# Altium project LimeSDR-X3_1v2.PrjPcb (part 2 of 16)

## Sheet 10_LMS3_RF.SchDoc: LMS7002M RF (LMS3)
size A3; Organization: Lime Microsystems; Address1: Surrey Tech Centre; Address2: Guildford GU2 7YG; Address3: Surrey; Address4: United Kingdom; Revision: v1.1; SheetNumber: 10; SheetTotal: 31
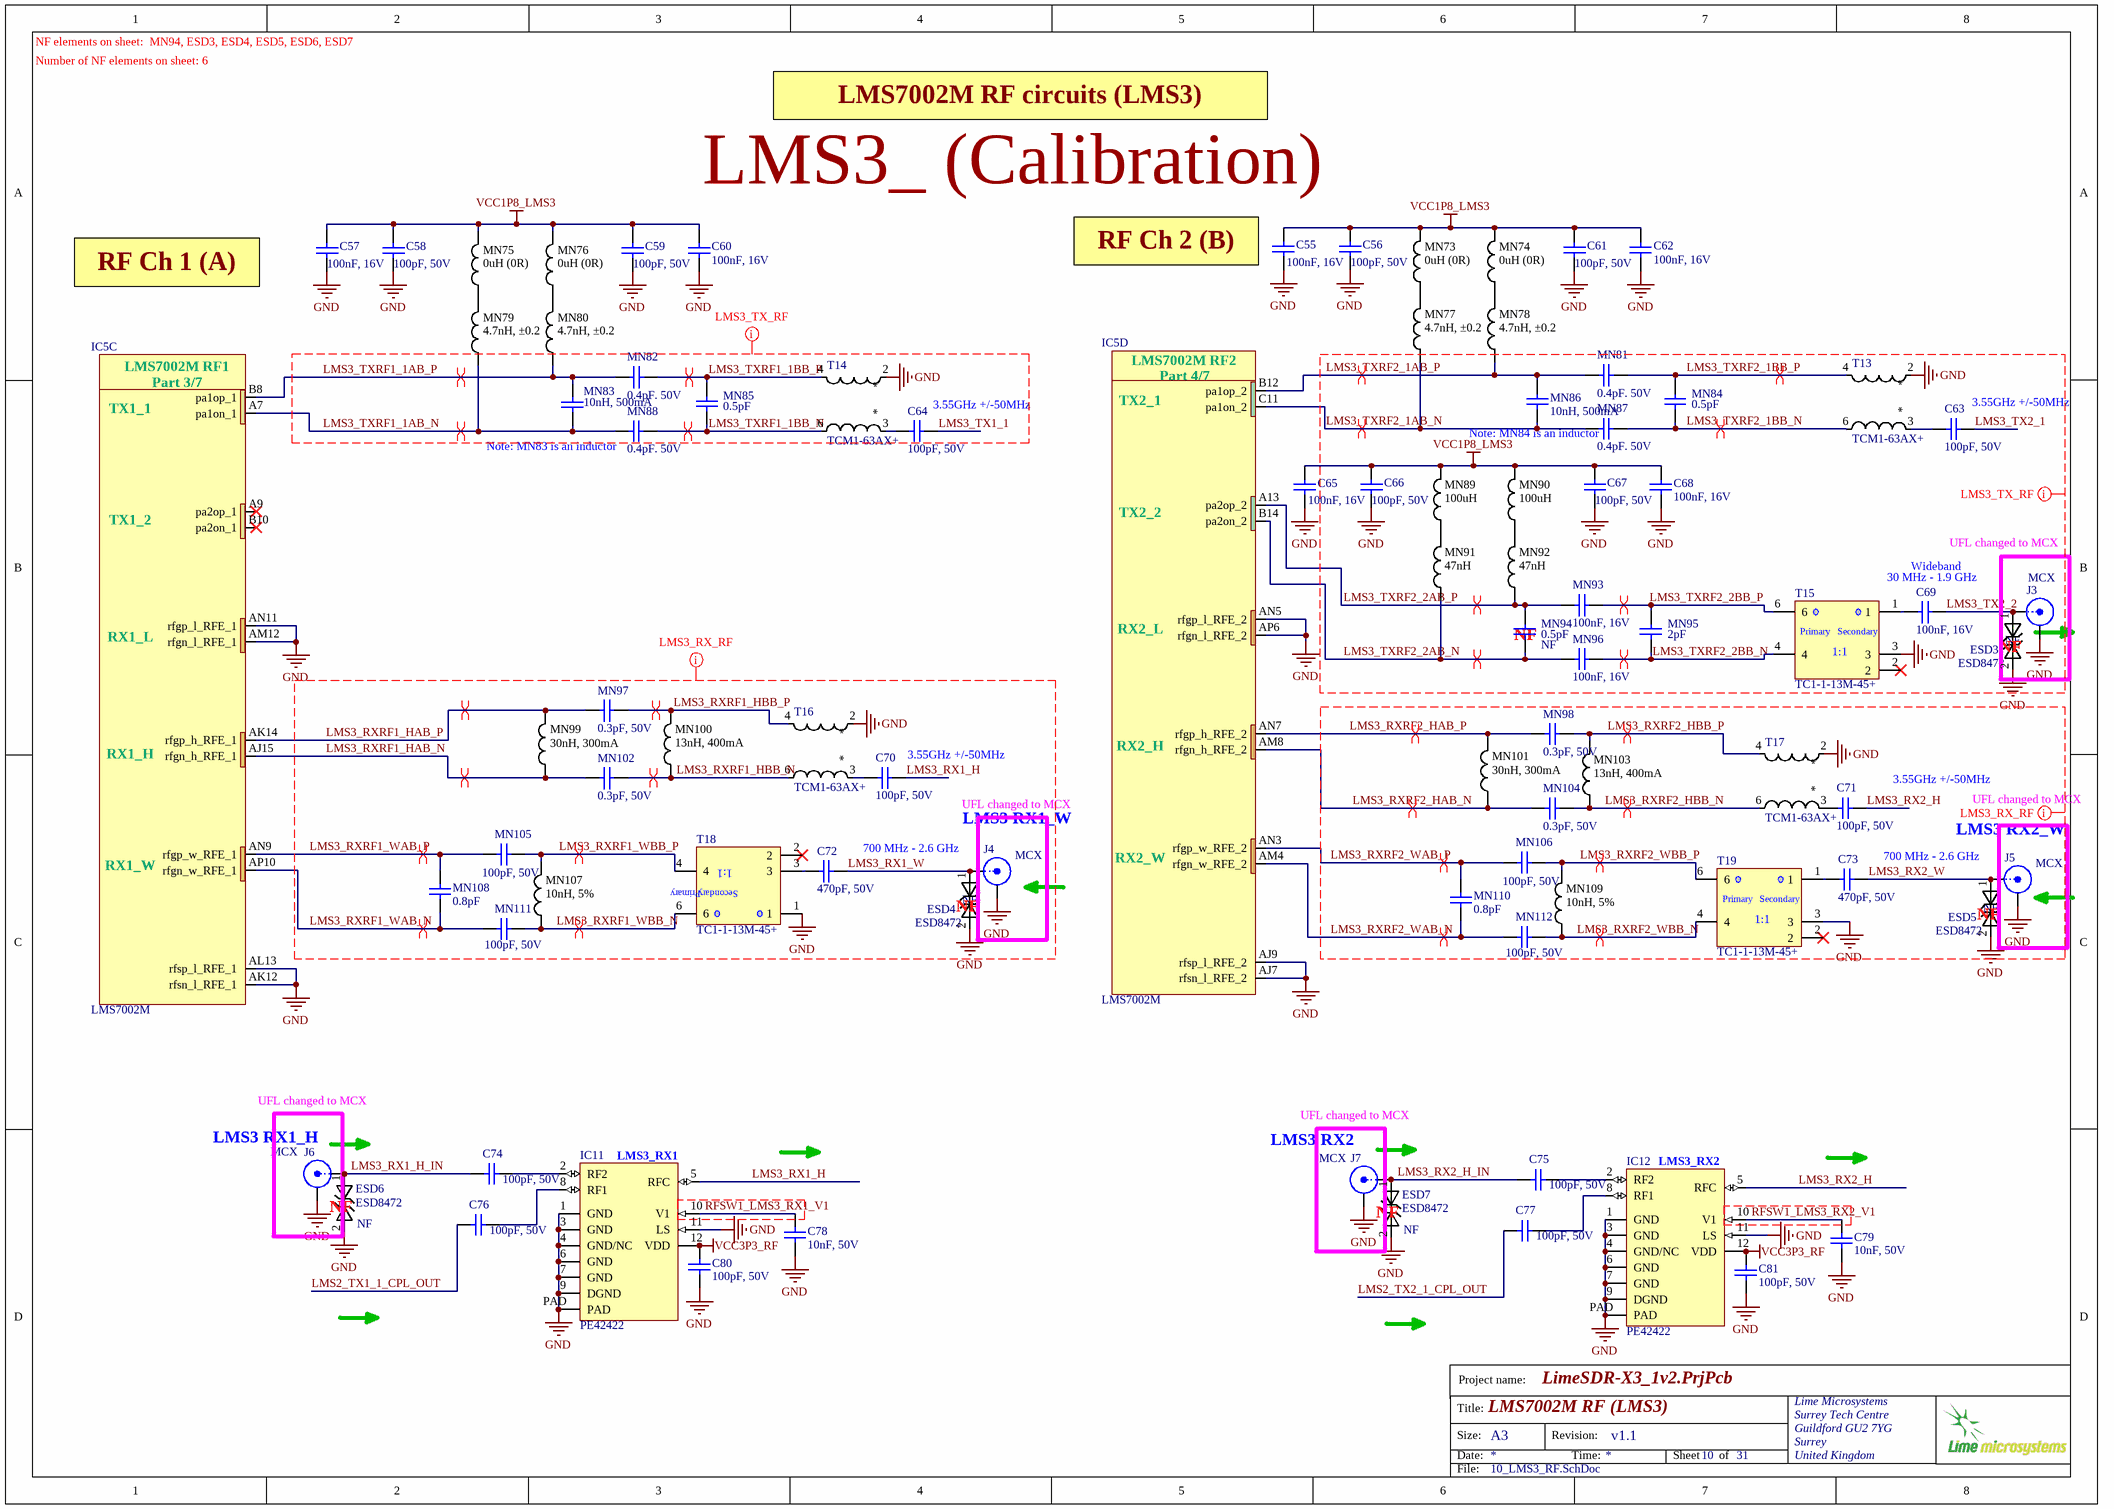
[diagram p2: 10_LMS3_RF.SchDoc]

### Parts
C55  100nF, 16V  [CAP0402]
C56  100pF, 50V  [CAP0402]
C57  100nF, 16V  [CAP0402]
C58  100pF, 50V  [CAP0402]
C59  100pF, 50V  [CAP0402]
C60  100nF, 16V  [CAP0402]
C61  100pF, 50V  [CAP0402]
C62  100nF, 16V  [CAP0402]
C63  100pF, 50V  [CAP0402]
C64  100pF, 50V  [CAP0402]
C65  100nF, 16V  [CAP0402]
C66  100pF, 50V  [CAP0402]
C67  100pF, 50V  [CAP0402]
C68  100nF, 16V  [CAP0402]
C69  100nF, 16V  [CAP0402]
C70  100pF, 50V  [CAP0402]
C71  100pF, 50V  [CAP0402]
C72  470pF, 50V  [CAP0402]
C73  470pF, 50V  [CAP0402]
C74  100pF, 50V  [CAP0402]
C75  100pF, 50V  [CAP0402]
C76  100pF, 50V  [CAP0402]
C77  100pF, 50V  [CAP0402]
C78  10nF, 50V  [CAP0402]
C79  10nF, 50V  [CAP0402]
C80  100pF, 50V  [CAP0402]
C81  100pF, 50V  [CAP0402]
ESD3  ESD8472  Assembly Info: NF  [ESD8472_X3DFN2]
ESD4  ESD8472  Assembly Info: NF  [ESD8472_X3DFN2]
ESD5  ESD8472  Assembly Info: NF  [ESD8472_X3DFN2]
ESD6  ESD8472  Assembly Info: NF  [ESD8472_X3DFN2]
ESD7  ESD8472  Assembly Info: NF  [ESD8472_X3DFN2]
IC5  LMS7002M  [LMS7002M_v5]  (parts C,D of 7)
IC11  PE42422  [PE42422_QFN12]
IC12  PE42422  [PE42422_QFN12]
J3  MCX  [MCX_connector_vertical_SM]
J4  MCX  [MCX_connector_vertical_SM]
J5  MCX  [MCX_connector_vertical_SM]
J6  MCX  [MCX_connector_vertical_SM]
J7  MCX  [MCX_connector_vertical_SM]
MN73  0uH (0R)  [RES0603]
MN74  0uH (0R)  [RES0603]
MN75  0uH (0R)  [RES0603]
MN76  0uH (0R)  [RES0603]
MN77  4.7nH, ±0.2  [RES0402]
MN78  4.7nH, ±0.2  [RES0402]
MN79  4.7nH, ±0.2  [RES0402]
MN80  4.7nH, ±0.2  [RES0402]
MN81  0.4pF. 50V  [CAP0402]
MN82  0.4pF. 50V  [CAP0402]
MN83  10nH, 500mA  [CAP0402]
MN84  0.5pF  [CAP0402]
MN85  0.5pF  [CAP0402]
MN86  10nH, 500mA  [CAP0402]
MN87  0.4pF. 50V  [CAP0402]
MN88  0.4pF. 50V  [CAP0402]
MN89  100uH  [RES0603]
MN90  100uH  [RES0603]
MN91  47nH  [RES0402]
MN92  47nH  [RES0402]
MN93  100nF, 16V  [CAP0402]
MN94  0.5pF  Assembly Info: NF  [CAP0402]
MN95  2pF  [CAP0402]
MN96  100nF, 16V  [CAP0402]
MN97  0.3pF, 50V  [CAP0402]
MN98  0.3pF, 50V  [CAP0402]
MN99  30nH, 300mA  [RES0402]
MN100  13nH, 400mA  [RES0402]
MN101  30nH, 300mA  [RES0402]
MN102  0.3pF, 50V  [CAP0402]
MN103  13nH, 400mA  [RES0402]
MN104  0.3pF, 50V  [CAP0402]
MN105  100pF, 50V  [CAP0402]
MN106  100pF, 50V  [CAP0402]
MN107  10nH, 5%  [RES0402]
MN108  0.8pF  [CAP0402]
MN109  10nH, 5%  [RES0402]
MN110  0.8pF  [CAP0402]
MN111  100pF, 50V  [CAP0402]
MN112  100pF, 50V  [CAP0402]
T13  TCM1-63AX+  [TCM1-63AX+_v2]
T14  TCM1-63AX+  [TCM1-63AX+_v2]
T15  TC1-1-13M-45+  [TC1-1-13MA+_JA4220-AL_]
T16  TCM1-63AX+  [TCM1-63AX+_v2]
T17  TCM1-63AX+  [TCM1-63AX+_v2]
T18  TC1-1-13M-45+  [TC1-1-13MA+_JA4220-AL_]
T19  TC1-1-13M-45+  [TC1-1-13MA+_JA4220-AL_]

### Nets
GND: C55.1 C56.1 C57.1 C58.1 C59.1 C60.1 C61.1 C62.1 C65.1 C66.1 C67.1 C68.1 C78.2 C79.2 C80.1 C81.1 ESD3.2 ESD4.2 ESD5.2 ESD6.2 ESD7.2 IC5.AJ7(rfsn_l_RFE_2) IC5.AJ9(rfsp_l_RFE_2) IC5.AK12(rfsn_l_RFE_1) IC5.AL13(rfsp_l_RFE_1) IC5.AM12(rfgn_l_RFE_1) IC5.AN5(rfgp_l_RFE_2) IC5.AN11(rfgp_l_RFE_1) IC5.AP6(rfgn_l_RFE_2) IC11.1(GND) IC11.3(GND) IC11.4(GND/NC) IC11.6(GND) IC11.7(GND) IC11.9(DGND) IC11.11(LS) IC11.PAD IC12.1(GND) IC12.3(GND) IC12.4(GND/NC) IC12.6(GND) IC12.7(GND) IC12.9(DGND) IC12.11(LS) IC12.PAD J3.2(Y) J4.2(Y) J5.2(Y) J6.2(Y) J7.2(Y) T13.2 T14.2 T15.3 T16.2 T17.2 T18.1 T19.3
VCC1P8_LMS3: C55.2 C56.2 C57.2 C58.2 C59.2 C60.2 C61.2 C62.2 C65.2 C66.2 C67.2 C68.2 MN73.2 MN74.2 MN75.2 MN76.2 MN89.2 MN90.2
VCC3P3_RF: C80.2 C81.2 IC11.12(VDD) IC12.12(VDD)
LMS2_TX1_1_CPL_OUT: C76.2
LMS2_TX2_1_CPL_OUT: C77.2
LMS3_RX1_H: C70.1 IC11.5(RFC)
LMS3_RX1_H_IN: C74.2 ESD6.1 J6.1(X)
LMS3_RX1_W: C72.1 ESD4.1 J4.1(X)
LMS3_RX2_H: C71.1 IC12.5(RFC)
LMS3_RX2_H_IN: C75.2 ESD7.1 J7.1(X)
LMS3_RX2_W: C73.1 ESD5.1 J5.1(X)
LMS3_RXRF1_HAB_N: IC5.AJ15(rfgn_h_RFE_1) MN99.1 MN102.2
LMS3_RXRF1_HAB_P: IC5.AK14(rfgp_h_RFE_1) MN97.2 MN99.2
LMS3_RXRF1_HBB_N: MN100.1 MN102.1 T16.6
LMS3_RXRF1_HBB_P: MN97.1 MN100.2 T16.4
LMS3_RXRF1_WAB_N: IC5.AP10(rfgn_w_RFE_1) MN108.2 MN111.2
LMS3_RXRF1_WAB_P: IC5.AN9(rfgp_w_RFE_1) MN105.2 MN108.1
LMS3_RXRF1_WBB_N: MN107.1 MN111.1 T18.6
LMS3_RXRF1_WBB_P: MN105.1 MN107.2 T18.4
LMS3_RXRF2_HAB_N: IC5.AM8(rfgn_h_RFE_2) MN101.1 MN104.2
LMS3_RXRF2_HAB_P: IC5.AN7(rfgp_h_RFE_2) MN98.2 MN101.2
LMS3_RXRF2_HBB_N: MN103.1 MN104.1 T17.6
LMS3_RXRF2_HBB_P: MN98.1 MN103.2 T17.4
LMS3_RXRF2_WAB_N: IC5.AM4(rfgn_w_RFE_2) MN110.2 MN112.2
LMS3_RXRF2_WAB_P: IC5.AN3(rfgp_w_RFE_2) MN106.2 MN110.1
LMS3_RXRF2_WBB_N: MN109.1 MN112.1 T19.4
LMS3_RXRF2_WBB_P: MN106.1 MN109.2 T19.6
LMS3_TX1_1: C64.1
LMS3_TX2_1: C63.1
LMS3_TX2_2: C69.1 ESD3.1 J3.1(X)
LMS3_TXRF1_1AB_N: IC5.A7(pa1on_1) MN79.1 MN83.2 MN88.2
LMS3_TXRF1_1AB_P: IC5.B8(pa1op_1) MN80.1 MN82.2 MN83.1
LMS3_TXRF1_1BB_N: MN85.1 MN88.1 T14.6
LMS3_TXRF1_1BB_P: MN82.1 MN85.2 T14.4
LMS3_TXRF2_1AB_N: IC5.C11(pa1on_2) MN77.1 MN86.1 MN87.2
LMS3_TXRF2_1AB_P: IC5.B12(pa1op_2) MN78.1 MN81.2 MN86.2
LMS3_TXRF2_1BB_N: MN84.1 MN87.1 T13.6
LMS3_TXRF2_1BB_P: MN81.1 MN84.2 T13.4
LMS3_TXRF2_2AB_N: IC5.B14(pa2on_2) MN91.1 MN94.1 MN96.1
LMS3_TXRF2_2AB_P: IC5.A13(pa2op_2) MN92.1 MN93.2 MN94.2
LMS3_TXRF2_2BB_N: MN95.1 MN96.2 T15.4
LMS3_TXRF2_2BB_P: MN93.1 MN95.2 T15.6
RFSW1_LMS3_RX1_V1: C78.1 IC11.10(V1)
RFSW1_LMS3_RX2_V1: C79.1 IC12.10(V1)
NetC63_2: C63.2 T13.3
NetC64_2: C64.2 T14.3
NetC69_2: C69.2 T15.1
NetC70_2: C70.2 T16.3
NetC71_2: C71.2 T17.3
NetC72_2: C72.2 T18.3
NetC73_2: C73.2 T19.1
NetC74_1: C74.1 IC11.2(RF2)
NetC75_1: C75.1 IC12.2(RF2)
NetC76_1: C76.1 IC11.8(RF1)
NetC77_1: C77.1 IC12.8(RF1)
NetMN73_1: MN73.1 MN77.2
NetMN74_1: MN74.1 MN78.2
NetMN75_1: MN75.1 MN79.2
NetMN76_1: MN76.1 MN80.2
NetMN89_1: MN89.1 MN91.2
NetMN90_1: MN90.1 MN92.2

Not connected (* = marked no-connect by the designer): IC5 A9(pa2op_1)* B10(pa2on_1)*; T15 2*; T18 2*; T19 2*

### Layout directives
differential pair: LMS3_RXRF1_HAB_N, LMS3_RXRF1_HAB_P, LMS3_RXRF1_HBB_N, LMS3_RXRF1_HBB_P, LMS3_RXRF1_WAB_N, LMS3_RXRF1_WAB_P, LMS3_RXRF1_WBB_N, LMS3_RXRF1_WBB_P, LMS3_RXRF2_HAB_N, LMS3_RXRF2_HAB_P, LMS3_RXRF2_HBB_N, LMS3_RXRF2_HBB_P, LMS3_RXRF2_WAB_N, LMS3_RXRF2_WAB_P, LMS3_RXRF2_WBB_N, LMS3_RXRF2_WBB_P, LMS3_TXRF1_1AB_N, LMS3_TXRF1_1AB_P, LMS3_TXRF1_1BB_N, LMS3_TXRF1_1BB_P, LMS3_TXRF2_1AB_N, LMS3_TXRF2_1AB_P, LMS3_TXRF2_1BB_N, LMS3_TXRF2_1BB_P, LMS3_TXRF2_2AB_N, LMS3_TXRF2_2AB_P, LMS3_TXRF2_2BB_N, LMS3_TXRF2_2BB_P
net class LMS3_TX_RF: GND, LMS3_TX1_1, LMS3_TX2_1, LMS3_TX2_2, LMS3_TXRF1_1AB_N, LMS3_TXRF1_1AB_P, LMS3_TXRF1_1BB_N, LMS3_TXRF1_1BB_P, LMS3_TXRF2_1AB_N, LMS3_TXRF2_1AB_P, LMS3_TXRF2_1BB_N, LMS3_TXRF2_1BB_P, LMS3_TXRF2_2AB_N, LMS3_TXRF2_2AB_P, LMS3_TXRF2_2BB_N, LMS3_TXRF2_2BB_P, VCC1P8_LMS3
net class LMS1_RX_RF: GND, LMS3_RX1_H, LMS3_RX1_W, LMS3_RXRF1_HAB_N, LMS3_RXRF1_HAB_P, LMS3_RXRF1_HBB_N, LMS3_RXRF1_HBB_P, LMS3_RXRF1_WAB_N, LMS3_RXRF1_WAB_P, LMS3_RXRF1_WBB_N, LMS3_RXRF1_WBB_P
net class LMS3_RX_RF: GND, LMS3_RX2_H, LMS3_RX2_W, LMS3_RXRF2_HAB_N, LMS3_RXRF2_HAB_P, LMS3_RXRF2_HBB_N, LMS3_RXRF2_HBB_P, LMS3_RXRF2_WAB_N, LMS3_RXRF2_WAB_P, LMS3_RXRF2_WBB_N, LMS3_RXRF2_WBB_P

### Notes on the sheet
- NF elements on sheet:  MN94, ESD3, ESD4, ESD5, ESD6, ESD7
- Number of NF elements on sheet: 6
- LMS7002M RF circuits (LMS3)
- LMS3_ (Calibration)
- RF Ch 1 (A)
- (near C55) RF Ch 2 (B)
- (near MN88) Note: MN83 is an inductor
- (near C64) 3.55GHz +/-50MHz
- (near MN87) Note: MN84 is an inductor
- (near C63) 3.55GHz +/-50MHz
- 30 MHz - 1.9 GHz
- Wideband
- UFL changed to MCX
- (near MN94) NF
- (near ESD3) NF
- (near C70) 3.55GHz +/-50MHz
- (near C71) 3.55GHz +/-50MHz
- 700 MHz - 2.6 GHz
- LMS3 RX1_W
- LMS3 RX2_W
- (near ESD4) NF
- (near ESD5) NF
- (near J6) LMS3 RX1_H
- (near IC11) LMS3_RX1
- (near J7) LMS3 RX2
- (near IC12) LMS3_RX2
- (near ESD6) NF
- (near ESD7) NF
- Project name:
- Title:
- Size:
- Date:
- A3
- Revision:
- Time:
- Sheet
- of
- File:
- (in symbol LMS7002Mr4, part C) LMS7002M RF1; Part 3/7; TX1_1; TX1_2; RX1_L; RX1_H; RX1_W
- (in symbol LMS7002Mr4, part D) LMS7002M RF2; Part 4/7; TX2_1; TX2_2; RX2_L; RX2_H; RX2_W
- (in symbol TC1-1-13M+) 1:1; Primary; Secondary

### Library data of the parts
C55 C57 C60 C62 C65 C68 C69 = Cap_0402: as C7 on sheet 08_LMS1_RF; Value: 100nF, 16V; Supplier 1: Mouser; Supplier Part Number 1: 81-GRM155R71C104KA88; Case Code - in: 0402; RoHS: RoHS Compliant; Operating Temperature Range: - 55 C to + 125 C; Series: GRM; Termination Style: SMD/SMT; Package / Case: 0402 (1005 metric); Voltage Rating DC: 16 V; Maximum Operating Temperature: + 125 C; Case Code - mm: 1005; Minimum Operating Temperature: - 55 C; Product Category: Low & Medium Capacitance SMD Ceramic Chip Capacitors; Packaging: Reel; Product: General Type MLCCs; Category: Multilayer Ceramic Capacitors MLCC - SMD/SMT; Brand: Murata Electronics; Case Width: 0.5 mm; RoHS - Mouser: Y; Standard Pack Qty: 10000; Minimum Order Quantity: 1; Reeling: True
C56 C58 C59 C61 C66 C67 = Cap_0402: as C8 on sheet 08_LMS1_RF; Value: 100pF, 50V; Supplier 1: Digi-Key; Supplier Part Number 1: 311-1024-1-ND; RoHS: RoHS Compliant; Category: Capacitors; Applications: General Purpose; Mounting Type: Surface Mount, MLCC; Capacitance: 100pF; Ratings: -; Packaging: Cut Tape (CT); Voltage - Rated: 50V; Size / Dimension: 0.039" L x 0.020" W (1.00mm x 0.50mm); Height - Seated (Max): -; Package / Case: 0402 (1005 Metric); Operating Temperature: -55°C ~ 125°C; Features: -; Lead Spacing: -; Lead Style: -; Thickness (Max): 0.022" (0.55mm)
C63 C64 C70 C71 C74-C77 C80 C81 MN105 MN106 MN111 MN112 = Cap_0402: as C15 on sheet 08_LMS1_RF; Value: 100pF, 50V; Capacitance: 100pF; Thickness (Max): 0.022" (0.55mm); Size / Dimension: 0.039" L x 0.020" W (1.00mm x 0.50mm); RoHS: RoHS Compliant; Ratings: -; Package / Case: 0402 (1005 Metric); Mounting Type: Surface Mount, MLCC; Height - Seated (Max): -; Features: -; Lead Spacing: -; Voltage - Rated: 50V; Operating Temperature: -55°C ~ 125°C; Packaging: Cut Tape (CT); Applications: General Purpose; Lead Style: -; Supplier 1: Digi-Key; Category: Capacitors; Supplier Part Number 1: 311-1024-1-ND
C72 C73 = Cap_0402: Manufacturer Part Number: C1005C0G1H471J050BA; Manufacturer: TDK Corporation; Part Description: 470pF ±5% 50V Ceramic Capacitor C0G, NP0 0402 (1005 Metric); Tolerance: ±5%; Temperature Coefficient: C0G, NP0; Value: 470pF, 50V; Supplier 1: Digi-Key; Supplier Part Number 1: 445-2656-6-ND; Ratings: -; Package / Case: 0402 (1005 Metric); Capacitance: 470pF; Packaging: Digi-Reel®; RoHS: RoHS Compliant; Lead Style: -; Thickness (Max): 0.022" (0.55mm); Size / Dimension: 0.039" L x 0.020" W (1.00mm x 0.50mm); Lead Spacing: -; Operating Temperature: -55°C ~ 125°C; Height - Seated (Max): -; Applications: General Purpose; Mounting Type: Surface Mount, MLCC; Voltage - Rated: 50V; Category: Capacitors; Features: -; Manufacturer Part Number 1: C1005C0G1H471J050BA
C78 C79 = Cap_0402: as C33 on sheet 08_LMS1_RF; Value: 10nF, 50V; Supplier 1: Digi-Key; Supplier Part Number 1: 490-4516-2-ND; RoHS: RoHS Compliant; Category: Capacitors; Stock 1: 10970000; Pricing 1: 10000=0.00185, 20000=0.00176, 30000=0.00167 (USD); Packaging: Tape & Reel (TR); Part Status: Active; Voltage - Rated: 50V; Operating Temperature: -55°C ~ 125°C; Features: -; Ratings: -; Applications: General Purpose; Mounting Type: Surface Mount, MLCC; Package / Case: 0402 (1005 Metric); Size / Dimension: 0.039" L x 0.020" W (1.00mm x 0.50mm); Height - Seated (Max): -; Thickness (Max): 0.022" (0.55mm); Lead Spacing: -; Lead Style: -; ComponentLink1URL: http://www.murata.com/~/media/webrenewal/support/library/catalog/products/capacitor/mlcc/c02e.ashx?la=en-us; ComponentLink1Description: http://www.murata.com/~/media/webrenewal/support/library/catalog/products/capacitor/mlcc/c02e.ashx?la=en-us
ESD3-ESD7 = ESD8472: as ESD1 on sheet 08_LMS1_RF; Supplier 1: Digi-Key; RoHS: RoHS Compliant; Category: Circuit Protection; Stock 1: 2295; Pricing 1: 1=0.39, 10=0.315, 100=0.2142, 500=0.16068, 1000=0.12051 (USD); Packaging: Cut Tape (CT); Part Status: Active; Type: Zener; Power - Peak Pulse: -; Applications: Automotive, RF Antenna; Operating Temperature: -55°C ~ 150°C (TJ); Mounting Type: Surface Mount; Package / Case: 2-XFDFN; Supplier Device Package: 2-X3DFN (0.62x0.32); ComponentLink1URL: http://www.onsemi.com/pub/Collateral/ESD8472-D.PDF; ComponentLink1Description: http://www.onsemi.com/pub/Collateral/ESD8472-D.PDF; Supplier Part Number 1: ESD8472MUT5GOSCT-ND
IC5 = LMS7002Mr4: as IC5 on sheet 07_LMS3_Misc; Supplier 1: Lime Microsystems; Supplier Part Number 1: LMS7002M; Manufacturer Part Number 1: LMS7002M
IC11 IC12 = PE42422: as IC7 on sheet 08_LMS1_RF; Supplier 1: Digi-Key; RoHS: RoHS Compliant; Category: RF/IF and RFID; Stock 1: 21993; Pricing 1: 1=1.32, 101=0.92 (USD); Packaging: Cut Tape (CT); Part Status: Active; P1dB: -; Features: -; Operating Temperature: -40°C ~ 85°C; Package / Case: 12-UFQFN Exposed Pad; Supplier Device Package: 12-QFN (2x2); ComponentLink1URL: http://www.psemi.com/pdf/datasheets/pe42422ds.pdf; ComponentLink1Description: http://www.psemi.com/pdf/datasheets/pe42422ds.pdf; Supplier Part Number 1: 1046-1062-1-ND
J3-J7 = RF_IF_connector: as J1 on sheet 08_LMS1_RF; ComponentLink1URL: https://datasheet.ciiva.com/5177/c908-22101t-37976-5177328.pdf?src-supplier=Mouser; ComponentLink1Description: https://datasheet.ciiva.com/5177/c908-22101t-37976-5177328.pdf?src-supplier=Mouser; ComponentLink2URL: https://datasheet.ciiva.com/643/c908-22101t-643558.pdf?src-supplier=Digi-Key; ComponentLink2Description: https://datasheet.ciiva.com/643/c908-22101t-643558.pdf?src-supplier=Digi-Key; ComponentLink3URL: https://datasheet.ciiva.com/7662/1636995-7662651.pdf?src-supplier=Element14; ComponentLink3Description: https://datasheet.ciiva.com/7662/1636995-7662651.pdf?src-supplier=Element14; ComponentLink4URL: https://datasheet.ciiva.com/5689/c908-22101t-5689787.pdf?src-supplier=Farnell; ComponentLink4Description: https://datasheet.ciiva.com/5689/c908-22101t-5689787.pdf?src-supplier=Farnell; ComponentLink5URL: https://datasheet.ciiva.com/7996/691284-7996807.pdf?src-supplier=Element14; ComponentLink5Description: https://datasheet.ciiva.com/7996/691284-7996807.pdf?src-supplier=Element14; ComponentLink6URL: https://datasheet.ciiva.com/643/c908-22101t-643559.pdf?src-supplier=Digi-Key; ComponentLink6Description: https://datasheet.ciiva.com/643/c908-22101t-643559.pdf?src-supplier=Digi-Key; ComponentLink7URL: https://datasheet.ciiva.com/643/c908-22101t-643560.pdf?src-supplier=Digi-Key; ComponentLink7Description: https://datasheet.ciiva.com/643/c908-22101t-643560.pdf?src-supplier=Digi-Key; Supplier 1: Digikey; Supplier Part Number 1: J548-ND; Stock 1: 6208; Pricing 1: 1=2,86, 10=2,595, 25=2,4576, 50=2,4006, 100=2,2862, 250=2,01248 (USD); RoHS: Yes; Housing Material: 152ConductorMaterial; ComponentLink8URL: https://datasheet.ciiva.com/643/dr-1333711201-643313.pdf?src-supplier=Digikey; ComponentLink8Description: https://datasheet.ciiva.com/643/dr-1333711201-643313.pdf?src-supplier=Digikey; ComponentLink9URL: https://datasheet.ciiva.com/3131/pi-133-3711-201-3131233.pdf?src-supplier=Avnet; ComponentLink9Description: https://datasheet.ciiva.com/3131/pi-133-3711-201-3131233.pdf?src-supplier=Avnet; ComponentLink10URL: https://datasheet.ciiva.com/23817/1720439-23817678.pdf?src-supplier=Newark; ComponentLink10Description: https://datasheet.ciiva.com/23817/1720439-23817678.pdf?src-supplier=Newark; ComponentLink11URL: https://datasheet.ciiva.com/23769/249599-23769434.pdf?src-supplier=Newark; ComponentLink11Description: https://datasheet.ciiva.com/23769/249599-23769434.pdf?src-supplier=Newark; ComponentLink12URL: https://datasheet.ciiva.com/22686/1720437-22686743.pdf?src-supplier=Element14; ComponentLink12Description: https://datasheet.ciiva.com/22686/1720437-22686743.pdf?src-supplier=Element14
MN73 MN75 = Inductor_0603: as MN1 on sheet 08_LMS1_RF; Value: 0uH (0R); Supplier 1: Digi-Key; Supplier Part Number 1: P0.0GCT-ND; RoHS: RoHS Compliant; Category: Resistors; Stock 1: 31663129; Pricing 1: 1=0.1, 10=0.04, 25=0.0292, 50=0.0222, 100=0.0164, 250=0.01252, 500=0.01002, 1000=0.00737 (USD); Packaging: Cut Tape (CT); Part Status: Active; Composition: Thick Film; Features: Automotive AEC-Q200; Temperature Coefficient: -; Operating Temperature: -55°C ~ 155°C; Package / Case: 0603 (1608 Metric); Supplier Device Package: 0603; Size / Dimension: 0.063" L x 0.032" W (1.60mm x 0.80mm); Height - Seated (Max): 0.022" (0.55mm); Failure Rate: -; ComponentLink1URL: http://industrial.panasonic.com/www-cgi/jvcr13pz.cgi?E+PZ+3+AOA0001+ERJ3GEY0R00V+7+WW; ComponentLink1Description: http://industrial.panasonic.com/www-cgi/jvcr13pz.cgi?E+PZ+3+AOA0001+ERJ3GEY0R00V+7+WW; Manufacturer Part Number 1: ERJ-3GEY0R00V
MN74 MN76 = Inductor_0603: as MN2 on sheet 08_LMS1_RF; Value: 0uH (0R); Category: Resistors; ComponentLink1Description: http://industrial.panasonic.com/www-cgi/jvcr13pz.cgi?E+PZ+3+AOA0001+ERJ3GEY0R00V+7+WW; ComponentLink1URL: http://industrial.panasonic.com/www-cgi/jvcr13pz.cgi?E+PZ+3+AOA0001+ERJ3GEY0R00V+7+WW; Composition: Thick Film; Failure Rate: -; Features: Automotive AEC-Q200; Height - Seated (Max): 0.022" (0.55mm); Operating Temperature: -55°C ~ 155°C; Package / Case: 0603 (1608 Metric); Packaging: Cut Tape (CT); Part Status: Active; Pricing 1: 1=0.1, 10=0.04, 25=0.0292, 50=0.0222, 100=0.0164, 250=0.01252, 500=0.01002, 1000=0.00737 (USD); RoHS: RoHS Compliant; Size / Dimension: 0.063" L x 0.032" W (1.60mm x 0.80mm); Stock 1: 31663129; Supplier 1: Digi-Key; Supplier Device Package: 0603; Supplier Part Number 1: P0.0GCT-ND; Temperature Coefficient: -; Manufacturer Part Number 1: ERJ-3GEY0R00V
MN77-MN80 = Inductor_0603: Manufacturer: Murata; Manufacturer Part Number 1: LQW15AN4N7C00D; Part Description: 4.7nH Unshielded Wirewound Inductor 750mA 70mOhm Max 0402 (1006 Metric); Core Material: Air; Current Rating: 750mA; DC Resistance (DCR): 70mR; Q Factor: 25; Self Resonant Frequency: 8GHz; Shielding: Unshielded; Test Frequency: 100MHz; Case/Package: 0402; Case Code (Imperial): 0402; Case Code (Metric): 1005; DC Current: 750mA; Depth: 0.7mm; Height: 0.5mm; Inductance: 4.7nH; Lead Free: Lead Free; Length: 1mm; Max DC Current: 750mA; Max Operating Temperature: 125°C; Military Standard: Not; Min Operating Temperature: -55°C; Mount: Surface Mount; Number of Pins: 2; Package Quantity: 10000; Packaging: Tape and Reel; Pricing 1: 1=0,18000, 10=0,16300, 100=0,10870, 500=0,09058, 1000=0,07608, 2500=0,06522 (USD); Radiation Hardening: No; REACH SVHC: No SVHC; RoHS: Yes; Stock 1: 48802; Supplier 1: Digi-Key; Supplier Part Number 1: 490-1139-1-ND; Termination: SMD/SMT; Value: 4.7nH, ±0.2; Weight: 2.8E-05oz; Width: 0.02inch
MN81 MN82 MN87 MN88 = Cap_0402: Part Description: 0.4 pF ±0.05pF 50V Ceramic Capacitor C0G, NP0 0402 (1005 Metric); Manufacturer: Murata; Manufacturer Part Number 1: GJM1555C1HR40WB01D; Capacitance: 0.4pF; Dielectric: C0G; Value: 0.4pF. 50V; Supplier 1: Arrow Electronics; Supplier Part Number 1: GJM1555C1HR40WB01D; Stock 1: 12385; Pricing 1: 1=0,20210, 10=0,14340, 25=0,12680, 100=0,08350, 250=0,08280, 500=0,07340, 1000=0,07270, 3000=0,07200, 6000=0,04460 (USD); RoHS: Yes; Mount: Surface Mount; Case/Package: 0402; Case Code (Metric): 1005; Case Code (Imperial): 0402; Min Operating Temperature: -55°C; Max Operating Temperature: 125°C; Packaging: Tape and Reel; Package Quantity: 10000; Voltage Rating: 50V; Voltage Rating (DC): 50V; Termination: SMD/SMT; Series: GJM; Construction: Flat; Length: 1mm; Width: 0.02inch; Height: 0.5mm; Thickness: 0.022inch; Depth: 0.5mm; Radiation Hardening: No; Lead Free: Lead Free; RoHS Compliant: Yes; ComponentLink1URL: https://datasheet.ciiva.com/11621/product-11621841.pdf?src-supplier=Avnet; ComponentLink1Description: https://datasheet.ciiva.com/11621/product-11621841.pdf?src-supplier=Avnet; ComponentLink2URL: https://datasheet.ciiva.com/169/partnumbering-e-01-169682.pdf?src-supplier=Digi-Key; ComponentLink2Description: https://datasheet.ciiva.com/169/partnumbering-e-01-169682.pdf?src-supplier=Digi-Key
MN83 MN86 = Cap_0402: Part Description: 10 nH Unshielded Wirewound Inductor 500 mA 170mOhm Max 0402 (1005 Metric); Manufacturer: Murata; Manufacturer Part Number 1: LQW15AN10NG00D; Core Material: Non-Magnetic,Air,Ferrite; Tolerance: 2%; Shielding: Unshielded; DC Resistance (DCR): 170mR; Self Resonant Frequency: 5.5GHz; Test Frequency: 100MHz; Current: 370mA; Value: 10nH, 500mA; Supplier 1: Arrow Electronics; Supplier Part Number 1: LQW15AN10NG00D; Stock 1: 20000; Pricing 1: 10000=0,07910, 20000=0,05460 (USD); RoHS: Yes; Mount: Surface Mount; Case/Package: 0402; Number of Pins: 2; Weight: 2.8E-05oz; Case Code (Metric): 1005; Case Code (Imperial): 0402; Min Operating Temperature: -55°C; Max Operating Temperature: 125°C; Inductance Tolerance: 2%; Packaging: Tape and Reel; Package Quantity: 10000; Current Rating: 500mA; Resistor Type: Wirewound; Inductance: 10nH; Max DC Current: 500mA; Termination: SMD/SMT; DC Current: 500mA; Length: 1mm; Width: 0.02inch; Height: 0.5mm; Height - Seated (Max): 0.024inch; Depth: 0.7mm; Radiation Hardening: No; REACH SVHC: No SVHC; Military Standard: Not; Lead Free: Lead Free; RoHS Compliant: Yes; ComponentLink1URL: https://datasheet.ciiva.com/11799/0900766b8090d800-11799107.pdf?src-supplier=RSComponents; ComponentLink1Description: https://datasheet.ciiva.com/11799/0900766b8090d800-11799107.pdf?src-supplier=RSComponents; ComponentLink2URL: https://datasheet.ciiva.com/6705/l0075s0080lqw15a-00-6705338.pdf?src-supplier=Digi-Key; ComponentLink2Description: https://datasheet.ciiva.com/6705/l0075s0080lqw15a-00-6705338.pdf?src-supplier=Digi-Key; ComponentLink3URL: https://datasheet.ciiva.com/6705/l0075s0080lqw15a-00-6705337.pdf?src-supplier=Digi-Key; ComponentLink3Description: https://datasheet.ciiva.com/6705/l0075s0080lqw15a-00-6705337.pdf?src-supplier=Digi-Key; ComponentLink4URL: https://datasheet.ciiva.com/6705/l0075s0080lqw15a-00-6705339.pdf?src-supplier=Digi-Key; ComponentLink4Description: https://datasheet.ciiva.com/6705/l0075s0080lqw15a-00-6705339.pdf?src-supplier=Digi-Key; ComponentLink5URL: https://datasheet.ciiva.com/4977/product-4977514.pdf?src-supplier=Mouser; ComponentLink5Description: https://datasheet.ciiva.com/4977/product-4977514.pdf?src-supplier=Mouser; ComponentLink6URL: https://datasheet.ciiva.com/8508/l0075s0080lqw15a-00-8508734.pdf?src-supplier=Avnet; ComponentLink6Description: https://datasheet.ciiva.com/8508/l0075s0080lqw15a-00-8508734.pdf?src-supplier=Avnet; ComponentLink7URL: https://datasheet.ciiva.com/25644/l0075s0080lqw15a-00-25644999.pdf?src-supplier=Future+Electronics; ComponentLink7Description: https://datasheet.ciiva.com/25644/l0075s0080lqw15a-00-25644999.pdf?src-supplier=Future+Electronics
MN84 MN85 MN94 = Cap_0402: as MN12 on sheet 08_LMS1_RF; Value: 0.5pF; Supplier 1: Digi-Key; Supplier Part Number 1: 311-1001-1-ND; RoHS: RoHS Compliant; Thickness (Max): 0.022" (0.55mm); Features: -; Height - Seated (Max): -; Lead Spacing: -; Applications: General Purpose; Packaging: Cut Tape (CT); Ratings: -; Size / Dimension: 0.039" L x 0.020" W (1.00mm x 0.50mm); Lead Style: -; Mounting Type: Surface Mount, MLCC; Operating Temperature: -55°C ~ 125°C; Package / Case: 0402 (1005 Metric); Category: Capacitors
MN89 = Inductor_0603: as MN17 on sheet 08_LMS1_RF; Value: 100uH; Supplier 1: Digi-Key; Supplier Part Number 1: 445-6150-6-ND; RoHS: RoHS Compliant; Category: Inductors, Coils, Chokes; Stock 1: 127797; Pricing 1: 1=0.27, 10=0.244, 100=0.1676, 500=0.14324, 1000=0.10971 (USD); Packaging: Digi-Reel®; Part Status: Active; Type: Wirewound; Material - Core: -; Q @ Freq: -; Ratings: -; Operating Temperature: -40°C ~ 105°C; Mounting Type: Surface Mount; Package / Case: 0603 (1608 Metric); Supplier Device Package: 0603 (1608 Metric); Size / Dimension: 0.063" L x 0.031" W (1.60mm x 0.80mm); Height - Seated (Max): 0.039" (1.00mm); ComponentLink1URL: https://media.digikey.com/pdf/Data%20Sheets/TDK%20PDFs/GLFR%20Series.pdf; ComponentLink1Description: https://media.digikey.com/pdf/Data%20Sheets/TDK%20PDFs/GLFR%20Series.pdf; Manufacturer Part Number 1: GLFR1608T101M-LR
MN90 = Inductor_0603: as MN19 on sheet 08_LMS1_RF; Value: 100uH; Category: Inductors, Coils, Chokes; ComponentLink1Description: https://media.digikey.com/pdf/Data%20Sheets/TDK%20PDFs/GLFR%20Series.pdf; ComponentLink1URL: https://media.digikey.com/pdf/Data%20Sheets/TDK%20PDFs/GLFR%20Series.pdf; Height - Seated (Max): 0.039" (1.00mm); Material - Core: -; Mounting Type: Surface Mount; Operating Temperature: -40°C ~ 105°C; Package / Case: 0603 (1608 Metric); Packaging: Digi-Reel®; Part Status: Active; Pricing 1: 1=0.27, 10=0.244, 100=0.1676, 500=0.14324, 1000=0.10971 (USD); Q @ Freq: -; Ratings: -; RoHS: RoHS Compliant; Size / Dimension: 0.063" L x 0.031" W (1.60mm x 0.80mm); Stock 1: 127797; Supplier 1: Digi-Key; Supplier Device Package: 0603 (1608 Metric); Supplier Part Number 1: 445-6150-6-ND; Type: Wirewound; Manufacturer Part Number 1: GLFR1608T101M-LR
MN91 MN92 = Inductor_0603: as MN21 on sheet 08_LMS1_RF; Supplier 1: Farnell; Supplier Part Number 1: 2285856; Packaging: Cut Tape; Inductor Case Style: 0402 [1005 Metric]; RoHS: Y-EX; value: 47nH
MN93 MN96 = Cap_0402: as MN25 on sheet 08_LMS1_RF; Value: 100nF, 16V; Supplier 1: Mouser; Supplier Part Number 1: 81-GRM155R71C104KA88; Case Code - in: 0402; RoHS: RoHS Compliant; Operating Temperature Range: - 55 C to + 125 C; Series: GRM; Termination Style: SMD/SMT; Package / Case: 0402 (1005 metric); Voltage Rating DC: 16 V; Type: General Purpose MLCC; Maximum Operating Temperature: + 125 C; Case Code - mm: 1005; Minimum Operating Temperature: - 55 C; Product Category: Low & Medium Capacitance SMD Ceramic Chip Capacitors; Packaging: Reel; Product: General Type MLCCs; Category: Multilayer Ceramic Capacitors MLCC - SMD/SMT; Brand: Murata Electronics; Case Width: 0.5 mm; RoHS - Mouser: Y; Standard Pack Qty: 10000; Minimum Order Quantity: 1; Reeling: True
MN95 = Cap_0402: as MN28 on sheet 08_LMS1_RF; Value: 2pF; Supplier 1: Farnell; Supplier Part Number 1: 2332536; Operating Temperature Max: 125; RoHS: YES; Operating Temperature Min: -55; Capacitance Tolerance ±: ± 0.1; Packaging: Cut Tape; MSL: MSL 1 - Unlimited; Manufacturer Part Number 1: 04025U2R0BAT2A
MN97 MN98 MN102 MN104 = Cap_0402: Part Description: 0.3 pF ±0.1pF 50V Ceramic Capacitor C0G, NP0 0402 (1005 Metric); Manufacturer: Johanson; Manufacturer Part Number 1: QSCF500Q0R3B1GV001T; Value: 0.3pF, 50V; ComponentLink1URL: https://datasheet.ciiva.com/11617/product-11617574.pdf?src-supplier=Avnet; ComponentLink1Description: https://datasheet.ciiva.com/11617/product-11617574.pdf?src-supplier=Avnet; ComponentLink2URL: https://datasheet.ciiva.com/169/partnumbering-e-01-169995.pdf?src-supplier=Digi-Key; ComponentLink2Description: https://datasheet.ciiva.com/169/partnumbering-e-01-169995.pdf?src-supplier=Digi-Key; ComponentLink3URL: https://datasheet.ciiva.com/6263/grm1555c1hr10wa01-01-6263952.pdf?src-supplier=Digi-Key; ComponentLink3Description: https://datasheet.ciiva.com/6263/grm1555c1hr10wa01-01-6263952.pdf?src-supplier=Digi-Key; ComponentLink4URL: https://datasheet.ciiva.com/6263/partnumbering-e-01-6263949.pdf?src-supplier=Digi-Key; ComponentLink4Description: https://datasheet.ciiva.com/6263/partnumbering-e-01-6263949.pdf?src-supplier=Digi-Key; ComponentLink5URL: https://datasheet.ciiva.com/6263/partnumbering-e-01-6263947.pdf?src-supplier=Digi-Key; ComponentLink5Description: https://datasheet.ciiva.com/6263/partnumbering-e-01-6263947.pdf?src-supplier=Digi-Key; ComponentLink6URL: https://datasheet.ciiva.com/5414/product-5414742.pdf?src-supplier=Mouser; ComponentLink6Description: https://datasheet.ciiva.com/5414/product-5414742.pdf?src-supplier=Mouser; ComponentLink7URL: https://datasheet.ciiva.com/11618/product-11618981.pdf?src-supplier=Avnet; ComponentLink7Description: https://datasheet.ciiva.com/11618/product-11618981.pdf?src-supplier=Avnet; Supplier 1: DigiKey; Supplier Part Number 1: 712-QSCF500Q0R3B1GV001TCT-ND; Stock 1: 139276; Pricing 1: 1=0,13, 10=0,093, 50=0,053, 100=0,0439, 500=0,0308, 1000=0,0255, 2500=0,02374, 5000=0,02172 (USD); RoHS: Yes; RoHS Compliant: Yes
MN99 MN101 = Inductor_0603: Part Description: 30 nH Unshielded Multilayer Inductor 300 mA 800mOhm Max 0402 (1005 Metric); Manufacturer: TDK; Manufacturer Part Number 1: MLG1005S30NJT000; Core Material: Non-Magnetic; Tolerance: 5%; Shielding: Unshielded; DC Resistance (DCR): 800mR; Self Resonant Frequency: 1.5GHz; Test Frequency: 100MHz; Value: 30nH, 300mA; ComponentLink1URL: https://datasheet.ciiva.com/11801/0900766b8090d800-11801389.pdf?src-supplier=RSComponents; ComponentLink1Description: https://datasheet.ciiva.com/11801/0900766b8090d800-11801389.pdf?src-supplier=RSComponents; ComponentLink2URL: https://datasheet.ciiva.com/17278/l0075s0080lqw15a-00-17278445.pdf?src-supplier=Avnet+Europe; ComponentLink2Description: https://datasheet.ciiva.com/17278/l0075s0080lqw15a-00-17278445.pdf?src-supplier=Avnet+Europe; ComponentLink3URL: https://datasheet.ciiva.com/16455/l0075s0080lqw15a-00-16455931.pdf?src-supplier=Future+Electronics; ComponentLink3Description: https://datasheet.ciiva.com/16455/l0075s0080lqw15a-00-16455931.pdf?src-supplier=Future+Electronics; ComponentLink4URL: https://datasheet.ciiva.com/11799/0900766b8090d800-11799107.pdf?src-supplier=RSComponents; ComponentLink4Description: https://datasheet.ciiva.com/11799/0900766b8090d800-11799107.pdf?src-supplier=RSComponents; ComponentLink5URL: https://datasheet.ciiva.com/6705/l0075s0080lqw15a-00-6705338.pdf?src-supplier=Digi-Key; ComponentLink5Description: https://datasheet.ciiva.com/6705/l0075s0080lqw15a-00-6705338.pdf?src-supplier=Digi-Key; ComponentLink6URL: https://datasheet.ciiva.com/6705/l0075s0080lqw15a-00-6705337.pdf?src-supplier=Digi-Key; ComponentLink6Description: https://datasheet.ciiva.com/6705/l0075s0080lqw15a-00-6705337.pdf?src-supplier=Digi-Key; ComponentLink7URL: https://datasheet.ciiva.com/6705/l0075s0080lqw15a-00-6705339.pdf?src-supplier=Digi-Key; ComponentLink7Description: https://datasheet.ciiva.com/6705/l0075s0080lqw15a-00-6705339.pdf?src-supplier=Digi-Key; ComponentLink8URL: https://datasheet.ciiva.com/4977/product-4977514.pdf?src-supplier=Mouser; ComponentLink8Description: https://datasheet.ciiva.com/4977/product-4977514.pdf?src-supplier=Mouser; ComponentLink9URL: https://datasheet.ciiva.com/8508/l0075s0080lqw15a-00-8508734.pdf?src-supplier=Avnet; ComponentLink9Description: https://datasheet.ciiva.com/8508/l0075s0080lqw15a-00-8508734.pdf?src-supplier=Avnet; ComponentLink10URL: https://datasheet.ciiva.com/25644/l0075s0080lqw15a-00-25644999.pdf?src-supplier=Future+Electronics; ComponentLink10Description: https://datasheet.ciiva.com/25644/l0075s0080lqw15a-00-25644999.pdf?src-supplier=Future+Electronics; Supplier 1: Digi-Key; Supplier Part Number 1: 445-6312-1-ND; Stock 1: 41662; Pricing 1: 1=0,13, 10=0,115, 25=0,1024, 50=0,0868, 100=0,0767, 250=0,07028, 500=0,06388, 1000=0,05366, 2500=0,046 (USD); RoHS: Yes; Mount: Surface Mount; Case/Package: 0402; Case Code (Metric): 1005; Case Code (Imperial): 0402; Min Operating Temperature: -55°C; Max Operating Temperature: 125°C; Current Rating: 300mA; Package Quantity: 10000; Packaging: Cut Tape; Inductance: 30nH; Series: MLG; Length: 0.039inch; Width: 0.02inch; Height - Seated (Max): 0.022inch; RoHS Compliant: Yes; ComponentLink11URL: https://datasheet.ciiva.com/29696/inductor-commercial-high-frequency-mlg-en-29696712.pdf?src-supplier=Digi-Key; ComponentLink11Description: https://datasheet.ciiva.com/29696/inductor-commercial-high-frequency-mlg-en-29696712.pdf?src-supplier=Digi-Key; ComponentLink12URL: https://datasheet.ciiva.com/29696/inductor-commercial-high-frequency-mlg-en-29696711.pdf?src-supplier=Digi-Key; ComponentLink12Description: https://datasheet.ciiva.com/29696/inductor-commercial-high-frequency-mlg-en-29696711.pdf?src-supplier=Digi-Key; ComponentLink13URL: https://datasheet.ciiva.com/29696/inductor-commercial-high-frequency-mlg-en-29696710.pdf?src-supplier=Digi-Key; ComponentLink13Description: https://datasheet.ciiva.com/29696/inductor-commercial-high-frequency-mlg-en-29696710.pdf?src-supplier=Digi-Key
MN100 MN103 = Inductor_0603: Part Description: 13 nH Unshielded Multilayer Inductor 400 mA 500mOhm Max 0402 (1005 Metric); Manufacturer: TDK; Manufacturer Part Number 1: MLG1005S13NJT000; Core Material: Non-Magnetic,Ceramic; Tolerance: 5%; Shielding: Unshielded; DC Resistance (DCR): 500mR; Self Resonant Frequency: 2.4GHz; Test Frequency: 100MHz; Value: 13nH, 400mA; ComponentLink1URL: https://datasheet.ciiva.com/11801/0900766b8090d800-11801389.pdf?src-supplier=RSComponents; ComponentLink1Description: https://datasheet.ciiva.com/11801/0900766b8090d800-11801389.pdf?src-supplier=RSComponents; ComponentLink2URL: https://datasheet.ciiva.com/17278/l0075s0080lqw15a-00-17278445.pdf?src-supplier=Avnet+Europe; ComponentLink2Description: https://datasheet.ciiva.com/17278/l0075s0080lqw15a-00-17278445.pdf?src-supplier=Avnet+Europe; ComponentLink3URL: https://datasheet.ciiva.com/16455/l0075s0080lqw15a-00-16455931.pdf?src-supplier=Future+Electronics; ComponentLink3Description: https://datasheet.ciiva.com/16455/l0075s0080lqw15a-00-16455931.pdf?src-supplier=Future+Electronics; ComponentLink4URL: https://datasheet.ciiva.com/11799/0900766b8090d800-11799519.pdf?src-supplier=RSComponents; ComponentLink4Description: https://datasheet.ciiva.com/11799/0900766b8090d800-11799519.pdf?src-supplier=RSComponents; ComponentLink5URL: https://datasheet.ciiva.com/6705/l0075s0080lqw15a-00-6705352.pdf?src-supplier=Digi-Key; ComponentLink5Description: https://datasheet.ciiva.com/6705/l0075s0080lqw15a-00-6705352.pdf?src-supplier=Digi-Key; ComponentLink6URL: https://datasheet.ciiva.com/4978/product-4978090.pdf?src-supplier=Mouser; ComponentLink6Description: https://datasheet.ciiva.com/4978/product-4978090.pdf?src-supplier=Mouser; ComponentLink7URL: https://datasheet.ciiva.com/17277/l0075s0080lqw15a-00-17277850.pdf?src-supplier=Avnet+Europe; ComponentLink7Description: https://datasheet.ciiva.com/17277/l0075s0080lqw15a-00-17277850.pdf?src-supplier=Avnet+Europe; ComponentLink8URL: https://datasheet.ciiva.com/6705/l0075s0080lqw15a-00-6705355.pdf?src-supplier=Digi-Key; ComponentLink8Description: https://datasheet.ciiva.com/6705/l0075s0080lqw15a-00-6705355.pdf?src-supplier=Digi-Key; ComponentLink9URL: https://datasheet.ciiva.com/6705/l0075s0080lqw15a-00-6705357.pdf?src-supplier=Digi-Key; ComponentLink9Description: https://datasheet.ciiva.com/6705/l0075s0080lqw15a-00-6705357.pdf?src-supplier=Digi-Key; ComponentLink10URL: https://datasheet.ciiva.com/11799/0900766b8090d5c4-11799120.pdf?src-supplier=RSComponents; ComponentLink10Description: https://datasheet.ciiva.com/11799/0900766b8090d5c4-11799120.pdf?src-supplier=RSComponents; ComponentLink11URL: https://datasheet.ciiva.com/6705/l0075s0080lqw15a-10-6705512.pdf?src-supplier=Digi-Key; ComponentLink11Description: https://datasheet.ciiva.com/6705/l0075s0080lqw15a-10-6705512.pdf?src-supplier=Digi-Key; ComponentLink12URL: https://datasheet.ciiva.com/6705/l0075s0080lqw15a-10-6705511.pdf?src-supplier=Digi-Key; ComponentLink12Description: https://datasheet.ciiva.com/6705/l0075s0080lqw15a-10-6705511.pdf?src-supplier=Digi-Key; ComponentLink13URL: https://datasheet.ciiva.com/6705/l0075s0080lqw15a-10-6705513.pdf?src-supplier=Digi-Key; ComponentLink13Description: https://datasheet.ciiva.com/6705/l0075s0080lqw15a-10-6705513.pdf?src-supplier=Digi-Key; ComponentLink14URL: https://datasheet.ciiva.com/4976/product-4976988.pdf?src-supplier=Mouser; ComponentLink14Description: https://datasheet.ciiva.com/4976/product-4976988.pdf?src-supplier=Mouser; ComponentLink15URL: https://datasheet.ciiva.com/8506/l0075s0080lqw15a-10-8506007.pdf?src-supplier=Avnet; ComponentLink15Description: https://datasheet.ciiva.com/8506/l0075s0080lqw15a-10-8506007.pdf?src-supplier=Avnet; ComponentLink16URL: https://datasheet.ciiva.com/16455/l0075s0080lqw15a-10-16455870.pdf?src-supplier=Future+Electronics; ComponentLink16Description: https://datasheet.ciiva.com/16455/l0075s0080lqw15a-10-16455870.pdf?src-supplier=Future+Electronics; Supplier 1: Digi-Key; Supplier Part Number 1: 445-6308-1-ND; Stock 1: 21172; Pricing 1: 1=0,13, 10=0,115, 25=0,1024, 50=0,0868, 100=0,0767, 250=0,07028, 500=0,06388, 1000=0,05366, 2500=0,046 (USD); RoHS: Yes; Mount: Surface Mount; Case/Package: 0402; Case Code (Metric): 1005; Case Code (Imperial): 0402; Min Operating Temperature: -55°C; Max Operating Temperature: 125°C; Package Quantity: 1; Packaging: Cut Tape; Current Rating: 400mA; Inductance: 13nH; Series: MLG; Length: 0.039inch; Width: 0.02inch; Height - Seated (Max): 0.022inch; RoHS Compliant: Yes; ComponentLink17URL: https://datasheet.ciiva.com/29699/inductor-commercial-high-frequency-mlg-en-29699007.pdf?src-supplier=Digi-Key; ComponentLink17Description: https://datasheet.ciiva.com/29699/inductor-commercial-high-frequency-mlg-en-29699007.pdf?src-supplier=Digi-Key; ComponentLink18URL: https://datasheet.ciiva.com/29699/inductor-commercial-high-frequency-mlg-en-29699006.pdf?src-supplier=Digi-Key; ComponentLink18Description: https://datasheet.ciiva.com/29699/inductor-commercial-high-frequency-mlg-en-29699006.pdf?src-supplier=Digi-Key
MN107 MN109 = Inductor_0603: Manufacturer Part Number 1: 0402HP-10NXJLU; Manufacturer: COILCRAFT; Part Description: INDUCTOR, RF, 10NH, 5%, 4.7GHZ, SMD; Product Range:0402HP Series; Inductance:10nH; Inductance Tolerance:± 5%; High Frequency Inductor Case:0402 [1005 Metric]; Self Resonant Frequency Min:4.7GHz; DC Resistance Max:0.11ohm; DC Current Rating:1.3A; Value: 10nH, 5%; Supplier 1: Farnell; Supplier Part Number 1: 2285830; RoHS: Y-EX
MN108 MN110 = Cap_0402: as MN9 on sheet 08_LMS1_RF; Value: 0.8pF; Applications: General Purpose; Operating Temperature: -55°C ~ 125°C; Size / Dimension: 0.039" L x 0.020" W (1.00mm x 0.50mm); Features: -; Supplier 1: Digi-Key; Height - Seated (Max): -; Category: Capacitors; Package / Case: 0402 (1005 Metric); Mounting Type: Surface Mount, MLCC; Lead Spacing: -; Thickness (Max): 0.022" (0.55mm); RoHS: RoHS Compliant; Supplier Part Number 1: 490-6269-1-ND; Packaging: Cut Tape (CT); Ratings: -; Lead Style: -; Manufacturer Part Number 1: GRM1555C1HR80BA01D
T13 T14 T16 T17 = Balun_v2: as T1 on sheet 08_LMS1_RF; Manufacturer Part Number 1: TCM1-63AX+; Supplier 1: Mini-circuits; Supplier Part Number 1: TCM1-63AX+
T15 T18 T19 = TC1-1-13M+: as T3 on sheet 08_LMS1_RF; Supplier 1: Minicircuits; Manufacturer Part Number 1: TC1-1-13M-45+; Supplier Part Number 1: TC1-1-13M-45+